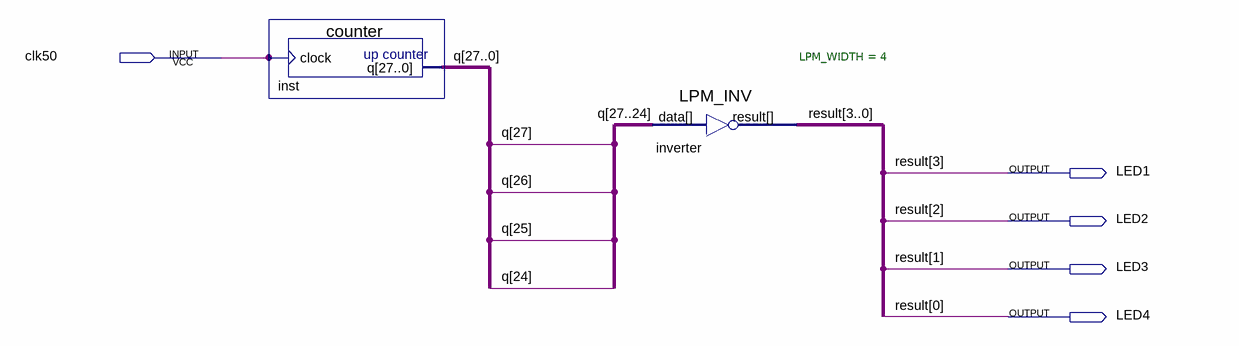
[diagram p0: schematic sheet]
// Quartus schematic led_blink.bdf as structural Verilog: 2 symbols, 5 pins
module led_blink (
  input  clk50,
  output LED1,
  output LED2,
  output LED3,
  output LED4
);

  wire [27:0] q;

  counter inst (.clock(clk50), .q(q));
  LPM_INV #(.LPM_WIDTH(4)) inverter (.data(q[27:24]), .result({LED1, LED2, LED3, LED4}));

  // Other names for the same wires on the sheet: result[3:0] = {LED1, LED2, LED3, LED4}
endmodule
